# Altium schematic sheet TPS922053_ch.SchDoc
size A; SheetNumber: 2; SheetTotal: 5
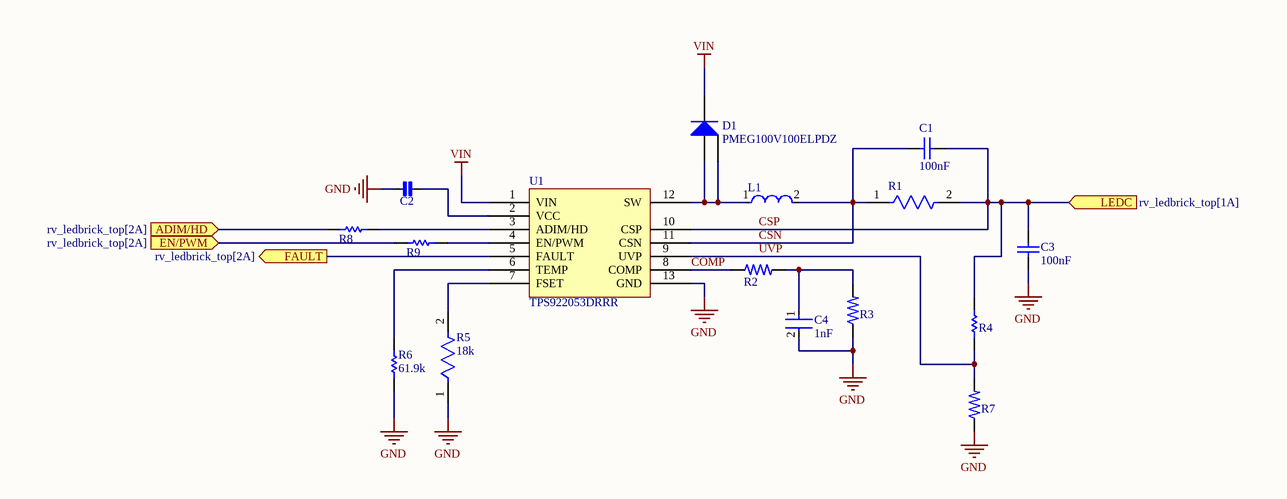
[diagram p0: TPS922053_ch.SchDoc]

## Parts
C1  value 100nF  [CAPC2013X94X50NL20T25]  (hidden comment: 0.1uF X7R 100V 0805)
C2  CAP 1uF 10V X7R 0603  [FP-CL10-IPC_B]  (value not drawn)
C3  value 100nF  [CAPC2013X94X50NL20T25]  (hidden comment: 0.1uF X7R 100V 0805)
C4  value 1nF  [FP-0603-L_1_6_0_15-W_0_81-IPC_B]  (hidden comment: 0.001uF 50V 0603 X7R)
D1  PMEG100V100ELPDZ  [DFN355P580X82-3N]
L1  MWSA0603S-100MT  [FP-IHLP-2525CZ-FP_2_413x3-MFG]  (value not drawn)
R1  MFL12HR100FT  [FP-CRA2512-MFG]  (value not drawn)
R2  1K 0603 1%  [RESC1608-IPC-NL]  (value not drawn)
R3  1M 0603 1%  [RESC1608-IPC-NL]  (value not drawn)
R4  309k 0603 1%  [RESC1608-IPC-NL]  (value not drawn)
R5  value 18k  [FP-CRCW0603-e3-IPC_B]  (hidden comment: 18k 0603)
R6  value 61.9k  [RESC1608X55X30ML15T15]  (hidden comment: ERJ-3EKF6192V)
R7  100k 0603 1%  [RESC1608-IPC-NL]  (value not drawn)
R8  10R 0603 1%  [RESC1608-IPC-NL]  (value not drawn)
R9  10R 0603 1%  [RESC1608-IPC-NL]  (value not drawn)
U1  TPS922053DRRR  [SON50P300X100_HS-13N]

## Ports
ADIM/HD (in, see rv_ledbrick_top[2A]), EN/PWM (in, see rv_ledbrick_top[2A]), FAULT (out, see rv_ledbrick_top[2A]), LEDC (in, see rv_ledbrick_top[1A])

## Nets
GND: C2.1 C3.1 C4.2 R3.1 R5.1 R6.1 R7.1 U1.13(GND)
VIN: D1.3(K) U1.1(VIN)
ADIM/HD: R8.1 ; port ADIM/HD
COMP: R2.1 U1.8(COMP)
CSN: C1.2 L1.2 R1.1 U1.11(CSN)
CSP: C1.1 C3.2 R1.2 R4.2 U1.10(CSP) ; port LEDC
EN/PWM: R9.1 ; port EN/PWM
FAULT: U1.5(FAULT) ; port FAULT
UVP: R4.1 R7.2 U1.9(UVP)
NetC2_2: C2.2 U1.2(VCC)
NetC4_1: C4.1 R2.2 R3.2
NetD1_1: D1.1(A) D1.2(A2) L1.1 U1.12(SW)
NetR5_2: R5.2 U1.7(FSET)
NetR6_2: R6.2 U1.6(TEMP)
NetR8_2: R8.2 U1.3(ADIM/HD)
NetR9_2: R9.2 U1.4(EN/PWM)

## Library data of the parts
C1 C3 = CMP-001-00130-1: Ceramic Capacitor, Multilayer, Ceramic, 100V, 5% +Tol, 5% -Tol, X7R, 15% TC, 0.1uF, Surface Mount, 0805; Multilayer: Yes; Packaging: Tape and Reel; Case/Package: 0805; RoHS Compliant: Yes; JESD-609 Code: e3; Temperature Characteristics Code: X7R; Tolerance  (fill in as +-): 5%; Height: 1.4mm; Tolerance (fill in as +-): 5%; Length: 2.01mm; Terminal Finish: Nickel; Package Style: SMTMeter; Mounting Technology: Surface Mount; Reach SVHC Compliant: Yes; Max Operating Temperature: 125°C; Termination: Wraparound; Dielectric Material: Ceramic; Width: 1.25mm; Min Operating Temperature: -55°C; Package Shape: Rectangular; Pins: 2; Capacitor Type: Ceramic; Rated DC Voltage (URdc): 100V
C2 = CMP-001-00085-7: Cap Ceramic 1uF 10V X7R 10% SMD 0603 125C Paper T/R
C4 = CMP-001-00131-2: Ceramic Capacitor, Multilayer, Ceramic, 50V, 10% +Tol, 10% -Tol, X7R, 15% TC, 0.001uF, Surface Mount, 0603; Multilayer: Yes; Rated DC Voltage (URdc): 50V; JESD-609 Code: e3; Package Style: SMTMeter; Width: 0.81mm; Terminal Finish: Nickel; Tolerance  (fill in as +-): 10%; RoHS Compliant: Yes; Mounting Technology: Surface Mount; Min Operating Temperature: -55°C; Tolerance (fill in as +-): 10%; Case/Package: 0603; Capacitor Type: Ceramic; Temperature Characteristics Code: X7R; Termination: Wraparound; Packaging: Tape and Reel; Length: 1.6mm; Max Operating Temperature: 125°C; Height: 0.9mm; Pins: 2; Reach SVHC Compliant: Yes; Package Shape: Rectangular; Dielectric Material: Ceramic
D1 = CMP-004-00041-2: Rectifier Diode, Schottky, 1 Phase, 1 Element, 100V V(RRM), Silicon; Reverse Recovery Time-Max: 0.014us; Case Connection: CATHODE; Non-rep Pk Forward Current-Max: 170A; Reference Standard: AEC-Q101; Max Reverse Current: 800nA; Package Body Material: Plastic; Number of Phases: 1; Application(s): EFFICIENCY; Forward Voltage: 850mV; Max Power Dissipation: 1.66W; Technology: SCHOTTKY; Reach SVHC Compliant: No; Diode Element Material: SILICON; Terminal Form: Flat; RoHS Compliant: Yes; Max Operating Temperature: 175°C; Rep Pk Reverse Voltage-Max: 100V; Diode Type: RECTIFIER; Min Operating Temperature: -55°C; Surface Mount: Yes; Package Shape: Rectangular; JESD-30 Code: R-PDSO-F3; Terminal Position: DUAL; Number of Elements: 1; Package Style: SMALL OUTLINEMeter; Pins: 3
L1 = CMP-006-00037-1: General Purpose Inductor, 10uH, 20%, 1 Element, Composite-Core, SMD, 2525; Case/Size Code: 2525; Inductor Application: HIGH CURRENT INDUCTOR; Package Length: 6.86mm; Shape/Size Description: RECTANGULAR PACKAGE; Package Height: 3mm; Core Material: Ferrite; Max Current Rating: 4A; Test Frequency: 100kHz; DC Resistance (DCR): 71.2mR; Channels: 1; Package Width: 6.47mm; Shielding: Shielded; Pins: 2; Terminal Placement: Dual Ended; Min Operating Temperature: -55°C; Inductance-Nom (L): 10uH; Surface Mount: Yes; Package Style: SMTMeter; Packaging: Tape and Reel; RoHS Compliant: Yes; Termination: Wraparound; Max Operating Temperature: 125°C; Terminal Finish: Nickel; Inductor Type: GENERAL PURPOSE INDUCTOR; Reach SVHC Compliant: Yes; Tolerance: 20%; JESD-609 Code: e3; Construction: Shielded
R1 = CMP-009-00243-1: Fixed Resistor, Metal Strip, 3W, 0.1ohm, 5.48V, 1% +/-Tol, 50ppm/Cel, Surface Mount, 2513
R2 = CMP-009-00193-3: Res Thick Film 0603 1K Ohm 1% 1/10W ±100ppm/°C Molded SMD Punched Carrier T/R
R3 = CMP-009-00187-4: VISHAY - CRCW06031M00FKEAHP - RES, AEC-Q200, THICK FILM, 1M, 0603
R4 = CMP-009-00208-2: Res Thick Film 0603 309K Ohm 1% 0.1W(1/10W) ±100ppm/C Molded SMD Paper T/R
R5 = CMP-009-00244-2: Fixed Resistor, Metal Glaze/thick Film, 0.1W, 18000ohm, 75V, 1% +/-Tol, 100ppm/Cel, Surface Mount, 0603; Rated Temperature: 70°C; Package Length: 1.55mm; Reference Standard: AEC-Q200; Package Height: 0.45mm; Package Width: 0.85mm; Power: 100mW; Temperature Coefficient: 100ppm/°C; Case/Package: 0603; Construction: Chip; Package Shape: Rectangular; Tolerance: 1%; Max Operating Temperature: 155°C; RoHS Compliant: Yes; Resistor Type: FIXED RESISTOR; Packaging: Tape and Reel; Terminal Finish: Nickel; Reach SVHC Compliant: Yes; Technology: METAL GLAZE/THICK FILM; Termination: Wraparound; Mounting Technology: Surface Mount; Min Operating Temperature: -55°C; JESD-609 Code: e3; Pins: 2; Package Style: SMTMeter; Working Voltage: 75V
R6 = CMP-009-00245-1: Fixed Resistor, Metal Glaze/thick Film, 0.1W, 61900ohm, 75V, 1% +/-Tol, 100ppm/Cel, Surface Mount, 0603; Package Length: 1.6mm; Package Height: 0.45mm; Rated Temperature: 70°C; Reference Standard: AEC-Q200; Package Width: 0.8mm; Temperature Coefficient: 100ppm/°C; Power: 100mW; Working Voltage: 75V; Reach SVHC Compliant: Yes; Tolerance: 1%; JESD-609 Code: e3; Terminal Finish: Nickel; Resistor Type: FIXED RESISTOR; Min Operating Temperature: -55°C; Max Operating Temperature: 155°C; Technology: METAL GLAZE/THICK FILM; Package Style: SMTMeter; Case/Package: 0603; Construction: Rectangular; Pins: 2; Packaging: Tape and Reel; RoHS Compliant: Yes; Mounting Technology: Surface Mount; Termination: Wraparound; Package Shape: Rectangular
R7 = CMP-009-00203-1: Res Thick Film 1.6 x 0.8 mm 100K Ohm 1% 0.1W(1/10W) 100ppm/ C Molded SMD Paper T/R
R8 R9 = CMP-009-00180-2: YAGEO (PHYCOMP) - RC0603FR-0710RL - RES, THICK FILM, 10R, 1%, 0.1W, 0603; Voltage Rating: 50V; Power Rating: 100mW; Temperature Coefficient: 200ppm/°C; Resistor Type: Thick Film; Width: 0.8mm; Max Operating Temperature: 155°C; Tolerance: 1%; Radiation Hardening: No; Packaging: Tape and Reel; Case Code (Imperial): 0603; Min Operating Temperature: -55°C; Termination: SMD/SMT; Length: 1.6mm; Military Standard: Not; Case Code (Metric): 1608; Contact Plating: Tin,Matte; Height: 0.45mm; REACH SVHC: No SVHC; Voltage Rating (DC): 50V; Number of Pins: 2; Depth: 0.8mm; Lead Free: Lead Free; Resistance: 10R; Case/Package: 0603
U1 = CMP-019-00085-2: 65-V, 2-A buck LED driver with inductive fast dimming and spread spectrum 12-WSON -40 to 125